# Altium schematic sheet IMx6Q.SchDoc
size A3
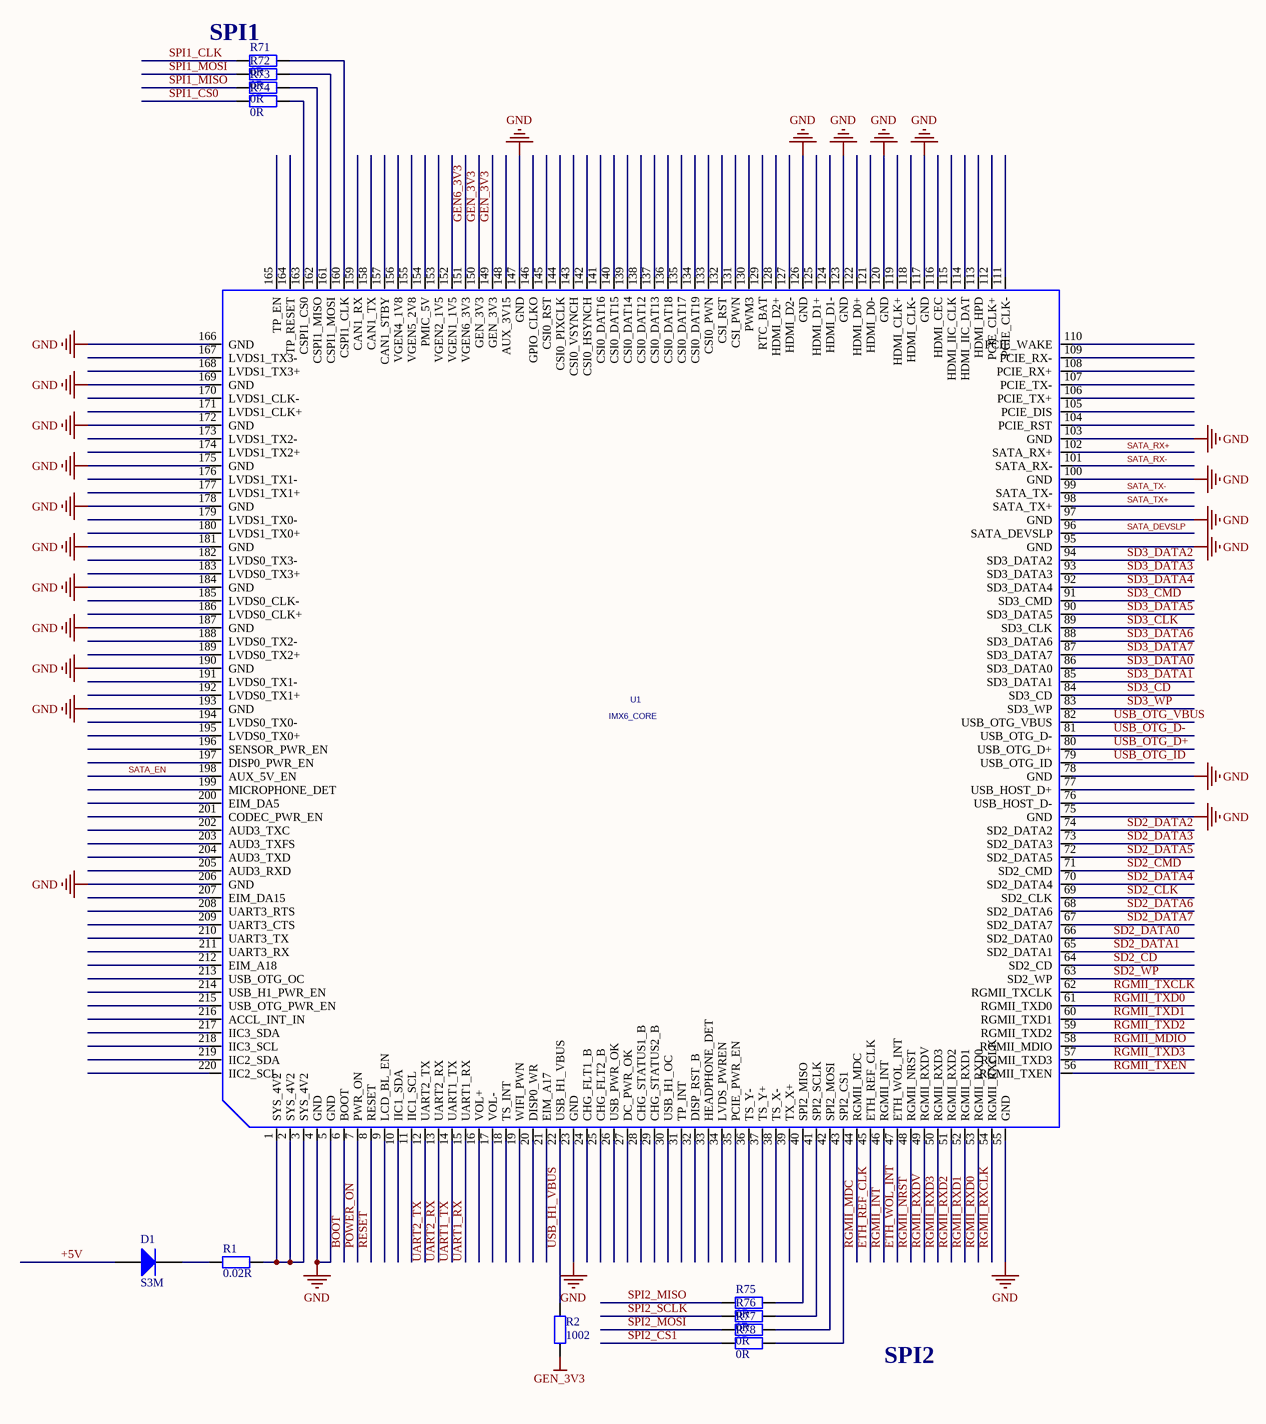
[diagram p0: IMx6Q.SchDoc]

## Parts
D1  S3M  [DSO-C2/X3.3]
R1  0.02R  [R1210]
R2  1002  [0603]
R71  0R  [0603]
R72  0R  [0603]
R73  0R  [0603]
R74  0R  [0603]
R75  0R  [0603]
R76  0R  [0603]
R77  0R  [0603]
R78  0R  [0603]
U1  IMX6_CORE  [IMX6_CORE]

## Nets
GEN_3V3: R2.2 U1.149(GEN_3V3) U1.150(GEN_3V3)
GND: U1.4(GND) U1.5(GND) U1.23(GND) U1.55(GND) U1.75(GND) U1.78(GND) U1.95(GND) U1.97(GND) U1.100(GND) U1.103(GND) U1.117(GND) U1.120(GND) U1.123(GND) U1.126(GND) U1.147(GND) U1.166(GND) U1.169(GND) U1.172(GND) U1.175(GND) U1.178(GND) U1.181(GND) U1.184(GND) U1.187(GND) U1.190(GND) U1.193(GND) U1.206(GND)
+5V: D1.1(A)
BOOT: U1.6(BOOT)
ETH_REF_CLK: U1.45(ETH_REF_CLK)
ETH_WOL_INT: U1.47(ETH_WOL_INT)
GEN6_3V3: U1.151(VGEN6_3V3)
POWER_ON: U1.7(PWR_ON)
RESET: U1.8(RESET)
RGMII_INT: U1.46(RGMII_INT)
RGMII_MDC: U1.44(RGMII_MDC)
RGMII_MDIO: U1.58(RGMII_MDIO)
RGMII_NRST: U1.48(RGMII_NRST)
RGMII_RXCLK: U1.54(RGMII_RXCLK)
RGMII_RXD0: U1.53(RGMII_RXD0)
RGMII_RXD1: U1.52(RGMII_RXD1)
RGMII_RXD2: U1.51(RGMII_RXD2)
RGMII_RXD3: U1.50(RGMII_RXD3)
RGMII_RXDV: U1.49(RGMII_RXDV)
RGMII_TXCLK: U1.62(RGMII_TXCLK)
RGMII_TXD0: U1.61(RGMII_TXD0)
RGMII_TXD1: U1.60(RGMII_TXD1)
RGMII_TXD2: U1.59(RGMII_TXD2)
RGMII_TXD3: U1.57(RGMII_TXD3)
RGMII_TXEN: U1.56(RGMII_TXEN)
SATA_DEVSLP: U1.96(SATA_DEVSLP)
SATA_EN: U1.198(AUX_5V_EN)
SATA_RX+: U1.102(SATA_RX+)
SATA_RX-: U1.101(SATA_RX-)
SATA_TX+: U1.98(SATA_TX+)
SATA_TX-: U1.99(SATA_TX-)
SD2_CD: U1.64(SD2_CD)
SD2_CLK: U1.69(SD2_CLK)
SD2_CMD: U1.71(SD2_CMD)
SD2_DATA0: U1.66(SD2_DATA0)
SD2_DATA1: U1.65(SD2_DATA1)
SD2_DATA2: U1.74(SD2_DATA2)
SD2_DATA3: U1.73(SD2_DATA3)
SD2_DATA4: U1.70(SD2_DATA4)
SD2_DATA5: U1.72(SD2_DATA5)
SD2_DATA6: U1.68(SD2_DATA6)
SD2_DATA7: U1.67(SD2_DATA7)
SD2_WP: U1.63(SD2_WP)
SD3_CD: U1.84(SD3_CD)
SD3_CLK: U1.89(SD3_CLK)
SD3_CMD: U1.91(SD3_CMD)
SD3_DATA0: U1.86(SD3_DATA0)
SD3_DATA1: U1.85(SD3_DATA1)
SD3_DATA2: U1.94(SD3_DATA2)
SD3_DATA3: U1.93(SD3_DATA3)
SD3_DATA4: U1.92(SD3_DATA4)
SD3_DATA5: U1.90(SD3_DATA5)
SD3_DATA6: U1.88(SD3_DATA6)
SD3_DATA7: U1.87(SD3_DATA7)
SD3_WP: U1.83(SD3_WP)
SPI1_CLK: R71.2
SPI1_CS0: R74.2
SPI1_MISO: R73.2
SPI1_MOSI: R72.2
SPI2_CS1: R78.2
SPI2_MISO: R75.2
SPI2_MOSI: R77.2
SPI2_SCLK: R76.2
UART1_RX: U1.15(UART1_RX)
UART1_TX: U1.14(UART1_TX)
UART2_RX: U1.13(UART2_RX)
UART2_TX: U1.12(UART2_TX)
USB_H1_VBUS: R2.1 U1.22(USB_H1_VBUS)
USB_OTG_D+: U1.80(USB_OTG_D+)
USB_OTG_D-: U1.81(USB_OTG_D-)
USB_OTG_ID: U1.79(USB_OTG_ID)
USB_OTG_VBUS: U1.82(USB_OTG_VBUS)
NetD1_2: D1.2(K) R1.1
NetR1_2: R1.2 U1.1(SYS_4V2) U1.2(SYS_4V2) U1.3(SYS_4V2)
NetR71_1: R71.1 U1.160(CSPI1_CLK)
NetR72_1: R72.1 U1.161(CSPI1_MOSI)
NetR73_1: R73.1 U1.162(CSPI1_MISO)
NetR74_1: R74.1 U1.163(CSPI1_CS0)
NetR75_1: R75.1 U1.40(SPI2_MISO)
NetR76_1: R76.1 U1.41(SPI2_SCLK)
NetR77_1: R77.1 U1.42(SPI2_MOSI)
NetR78_1: R78.1 U1.43(SPI2_CS1)

Not connected (* = marked no-connect by the designer): U1 9(LCD_BL_EN) 10(IIC1_SDA) 11(IIC1_SCL) 16(VOL+) 17(VOL-) 18(TS_INT) 19(WIFI_PWN) 20(DISP0_WR) 21(EIM_A17) 24(CHG_FLT1_B) 25(CHG_FLT2_B) 26(USB_PWR_OK) 27(DC_PWR_OK) 28(CHG_STATUS1_B) 29(CHG_STATUS2_B) 30(USB_H1_OC) 31(TP_INT) 32(DISP_RST_B) 33(HEADPHONE_DET) 34(LVDS_PWREN) 35(PCIE_PWR_EN) 36(TS_Y-) 37(TS_Y+) 38(TS_X-) 39(TX_X+) 76(USB_HOST_D-) 77(USB_HOST_D+) 104(PCIE_RST) 105(PCIE_DIS) 106(PCIE_TX+) 107(PCIE_TX-) 108(PCIE_RX+) 109(PCIE_RX-) 110(PCIE_WAKE) 111(PCIE_CLK-) 112(PCIE_CLK+) 113(HDMI_HPD) 114(HDMI_IIC_DAT) 115(HDMI_IIC_CLK) 116(HDMI_CEC) 118(HDMI_CLK-) 119(HDMI_CLK+) 121(HDMI_D0-) 122(HDMI_D0+) 124(HDMI_D1-) 125(HDMI_D1+) 127(HDMI_D2-) 128(HDMI_D2+) 129(RTC_BAT) 130(PWM3) 131(CSI_PWN) 132(CSI_RST) 133(CSI0_PWN) 134(CSI0_DAT19) 135(CSI0_DAT17) 136(CSI0_DAT18) 137(CSI0_DAT13) 138(CSI0_DAT12) 139(CSI0_DAT14) 140(CSI0_DAT15) 141(CSI0_DAT16) 142(CSI0_HSYNCH) 143(CSI0_VSYNCH) 144(CSI0_PIXCLK) 145(CSI0_RST) 146(GPIO_CLKO) 148(AUX_3V15) 152(VGEN1_1V5) 153(VGEN2_1V5) 154(PMIC_5V) 155(VGEN5_2V8) 156(VGEN4_1V8) 157(CAN1_STBY) 158(CAN1_TX) 159(CAN1_RX) 164(TP_RESET) 165(TP_EN) 167(LVDS1_TX3-) 168(LVDS1_TX3+) 170(LVDS1_CLK-) 171(LVDS1_CLK+) 173(LVDS1_TX2-) 174(LVDS1_TX2+) 176(LVDS1_TX1-) 177(LVDS1_TX1+) 179(LVDS1_TX0-) 180(LVDS1_TX0+) 182(LVDS0_TX3-) 183(LVDS0_TX3+) 185(LVDS0_CLK-) 186(LVDS0_CLK+) 188(LVDS0_TX2-) 189(LVDS0_TX2+) 191(LVDS0_TX1-) 192(LVDS0_TX1+) 194(LVDS0_TX0-) 195(LVDS0_TX0+) 196(SENSOR_PWR_EN) 197(DISP0_PWR_EN) 199(MICROPHONE_DET) 200(EIM_DA5) 201(CODEC_PWR_EN) 202(AUD3_TXC) 203(AUD3_TXFS) 204(AUD3_TXD) 205(AUD3_RXD) 207(EIM_DA15) 208(UART3_RTS) 209(UART3_CTS) 210(UART3_TX) 211(UART3_RX) 212(EIM_A18) 213(USB_OTG_OC) 214(USB_H1_PWR_EN) 215(USB_OTG_PWR_EN) 216(ACCL_INT_IN) 217(IIC3_SDA) 218(IIC3_SCL) 219(IIC2_SDA) 220(IIC2_SCL)

## Notes on the sheet
- (near R71) SPI1
- SPI2

## Library data of the parts
D1 = Diode: Default Diode; Published: 8-Jun-2000; LatestRevisionDate: 17-Jul-2002; LatestRevisionNote: Re-released for DXP Platform.; PackageVersion: Sep-1996; PackageReference: SMC; Publisher: Altium Limited; Code_JEDEC: DO-214-AB
R1 R2 = Res2: Resistor; Value: 1K; Published: 8-Jun-2000; LatestRevisionDate: 17-Jul-2002; LatestRevisionNote: Re-released for DXP Platform.; PackageReference: AXIAL-0.4; Publisher: Altium Limited
R71-R78 = 电阻
U1 = IMX6_CORE: PCB DECAL: IMX6_CORE